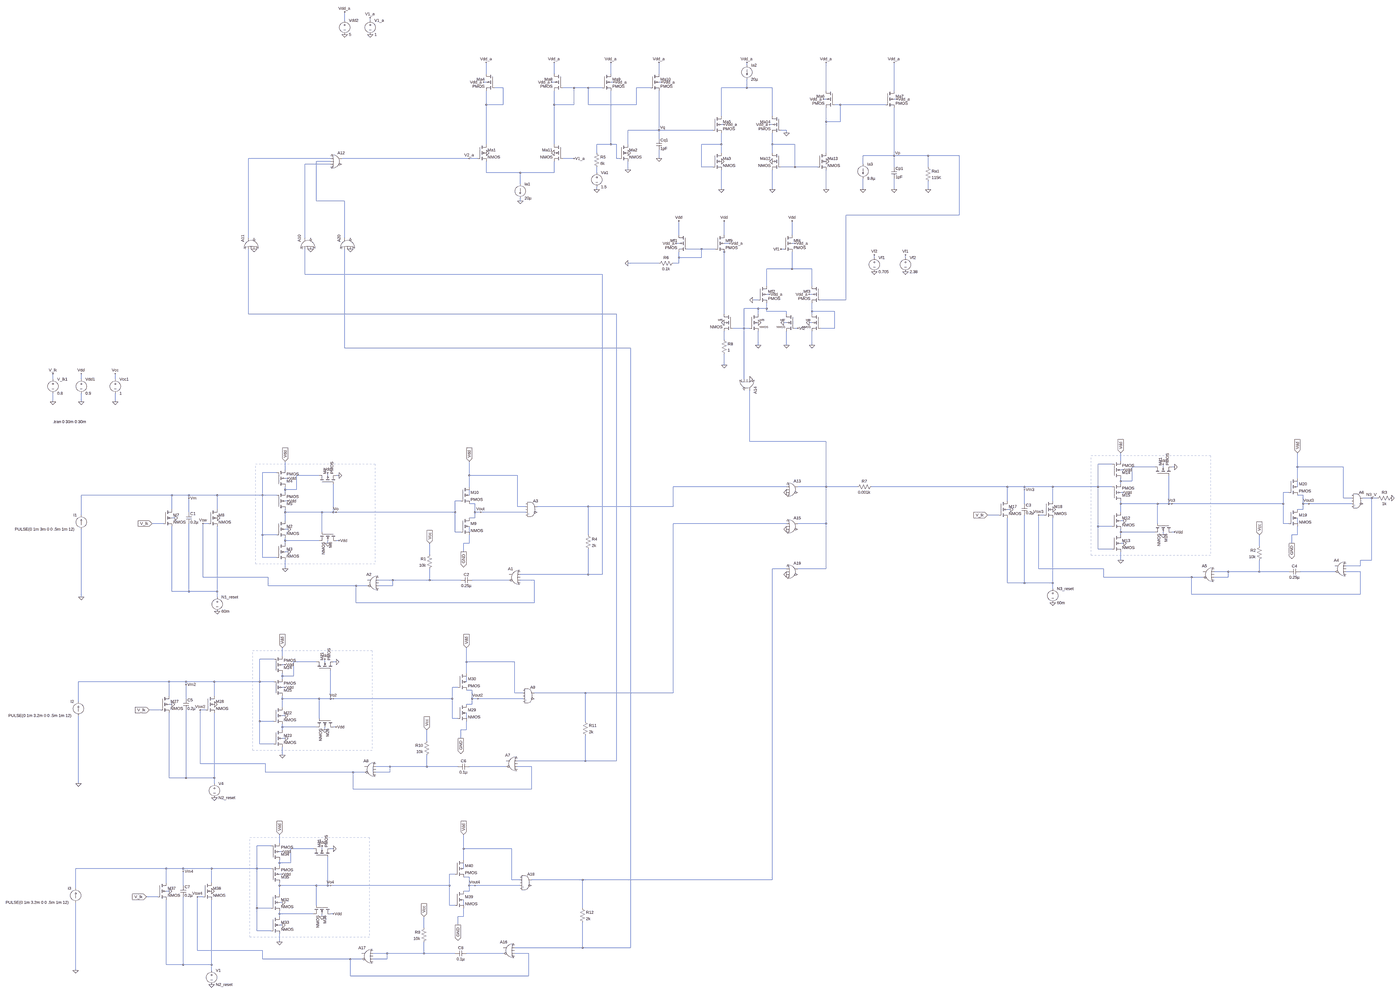
[diagram p0: schematic 2N-A.asc, whole sheet]
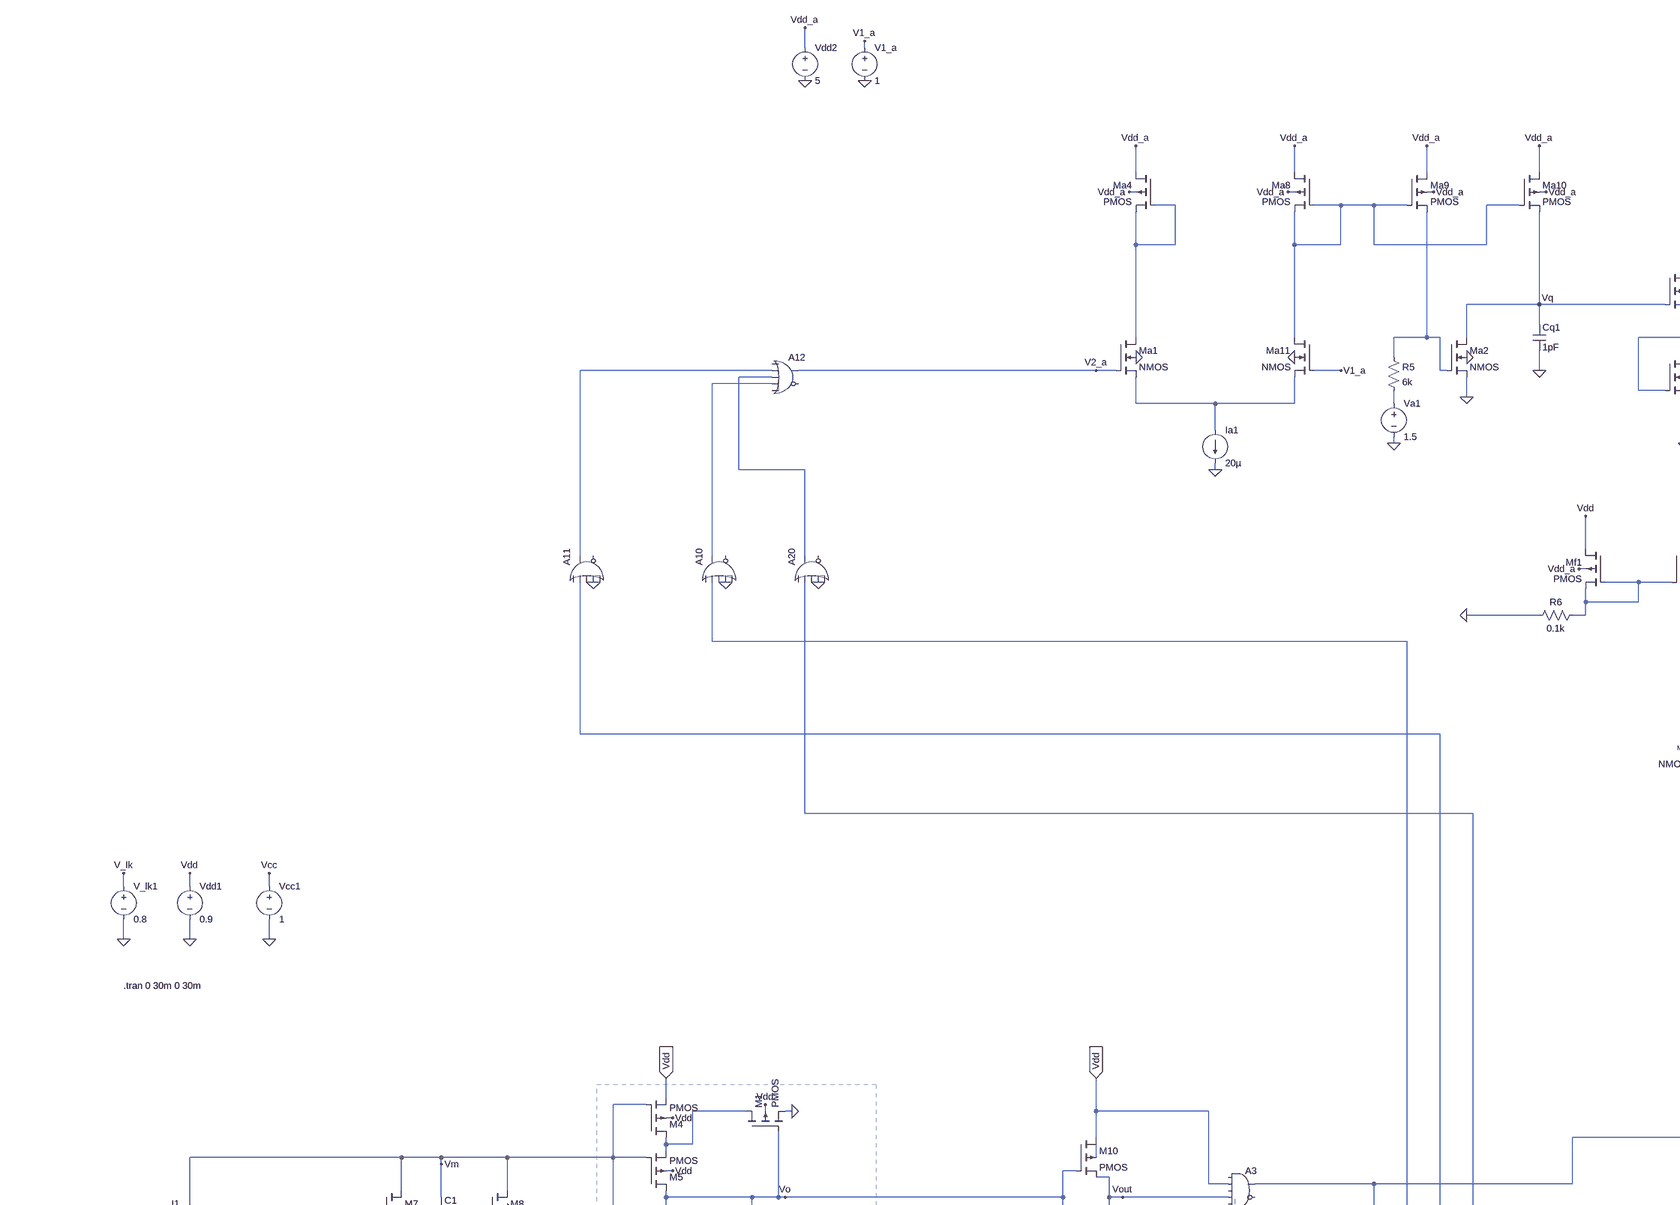
[diagram p1: schematic 2N-A.asc, part, row 1 of 2, column 1 of 2]
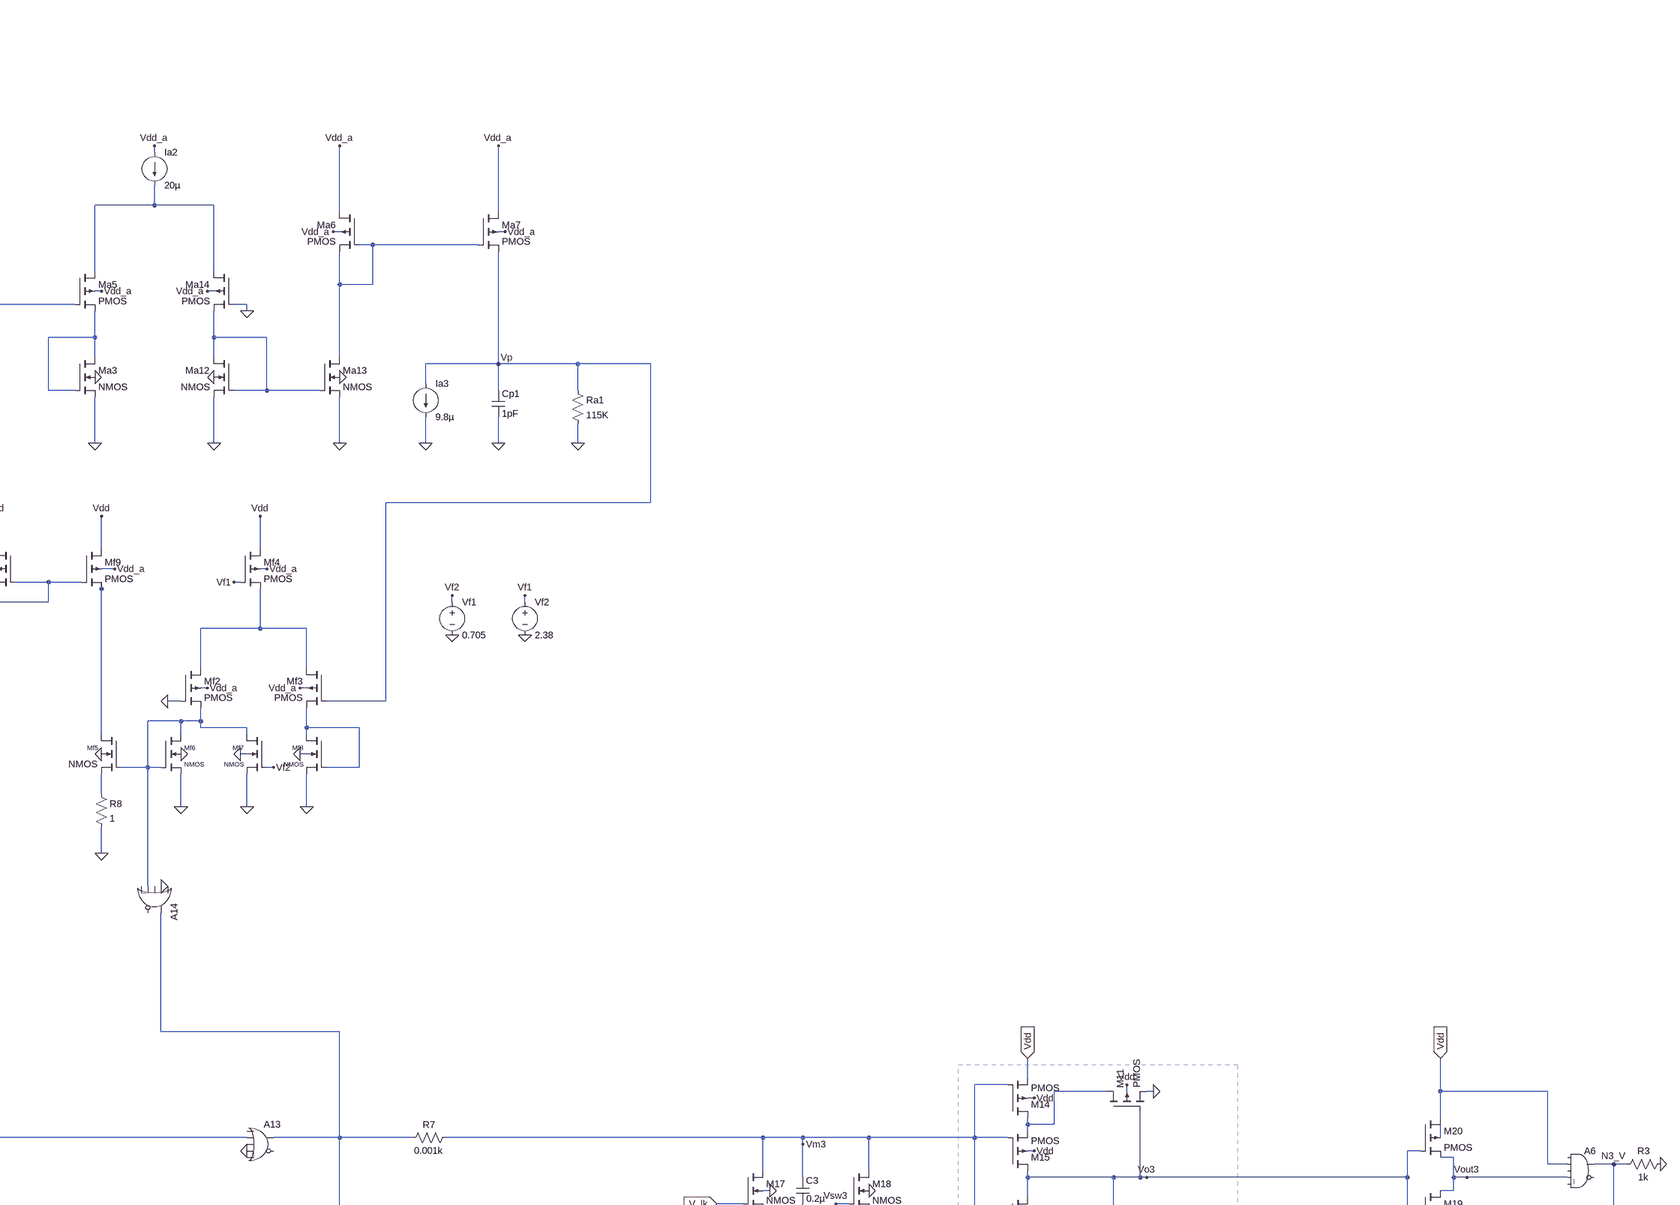
[diagram p2: schematic 2N-A.asc, part, row 1 of 2, column 2 of 2]
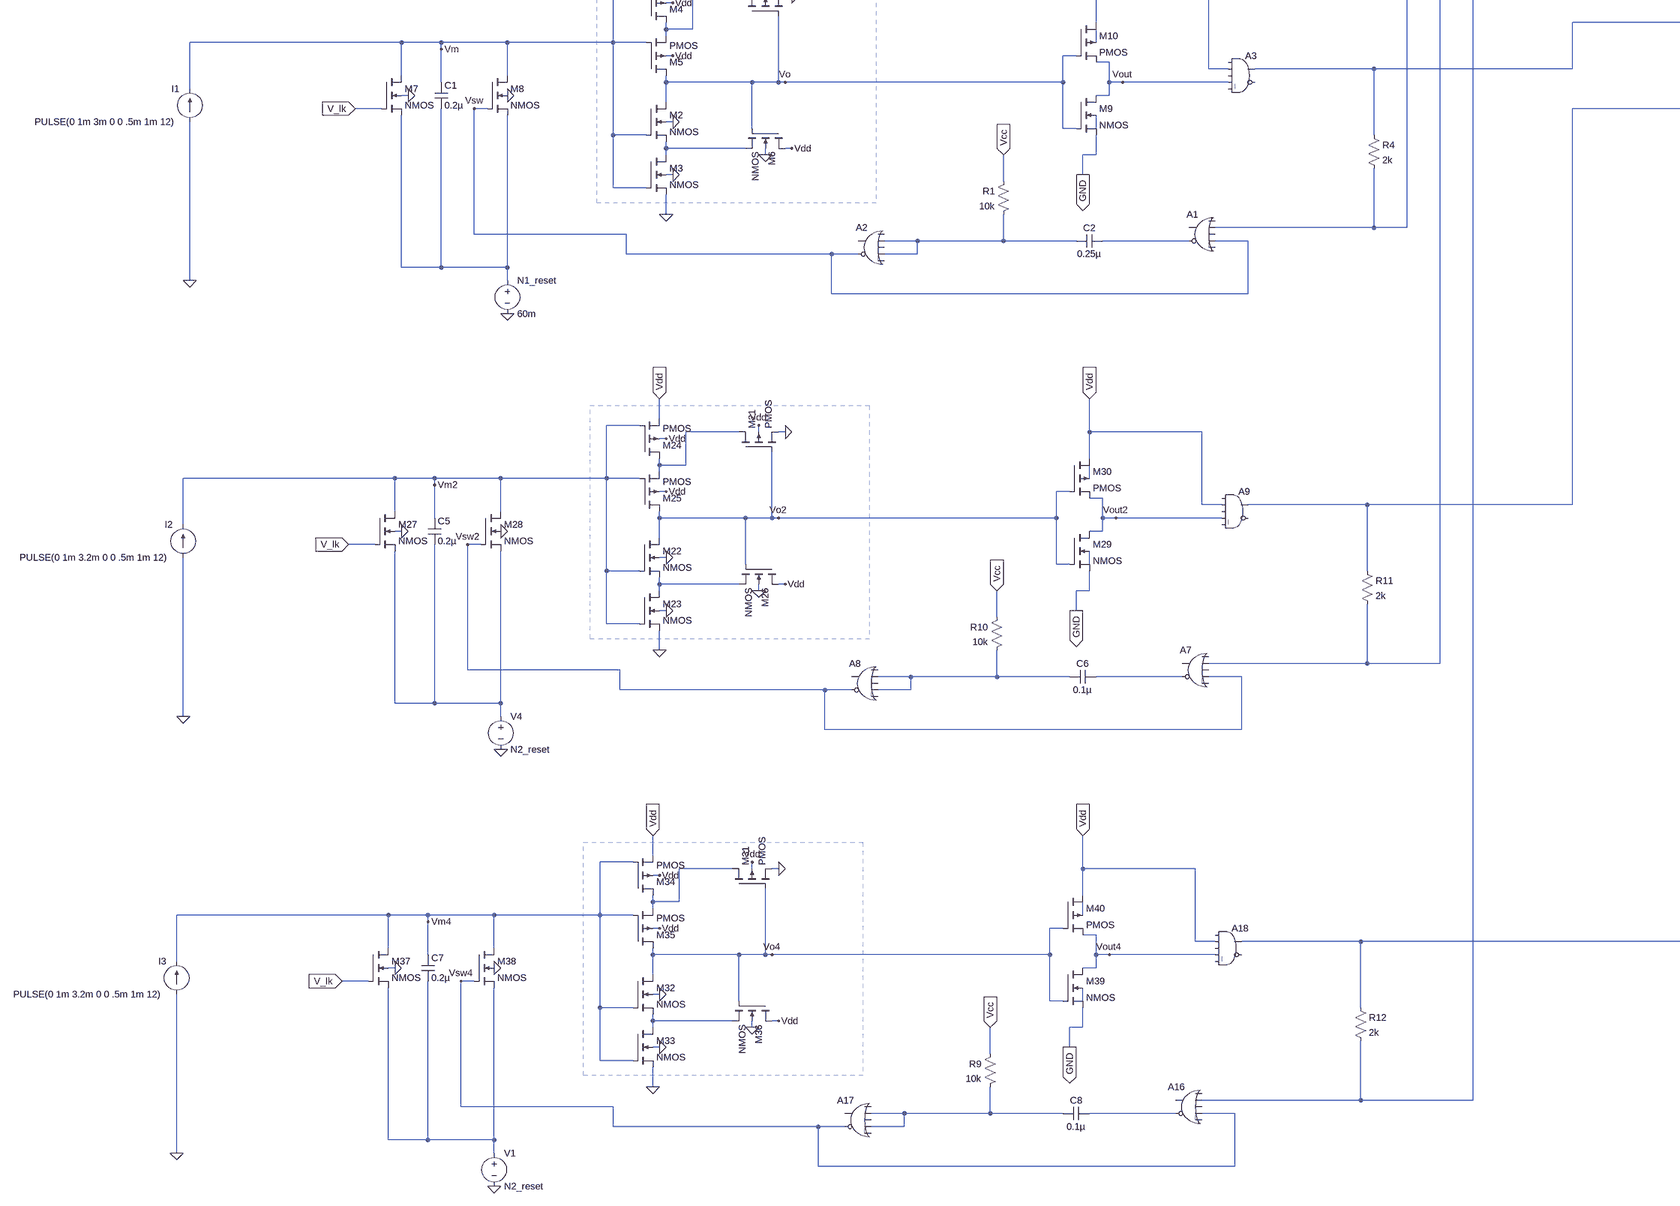
[diagram p3: schematic 2N-A.asc, part, row 2 of 2, column 1 of 2]
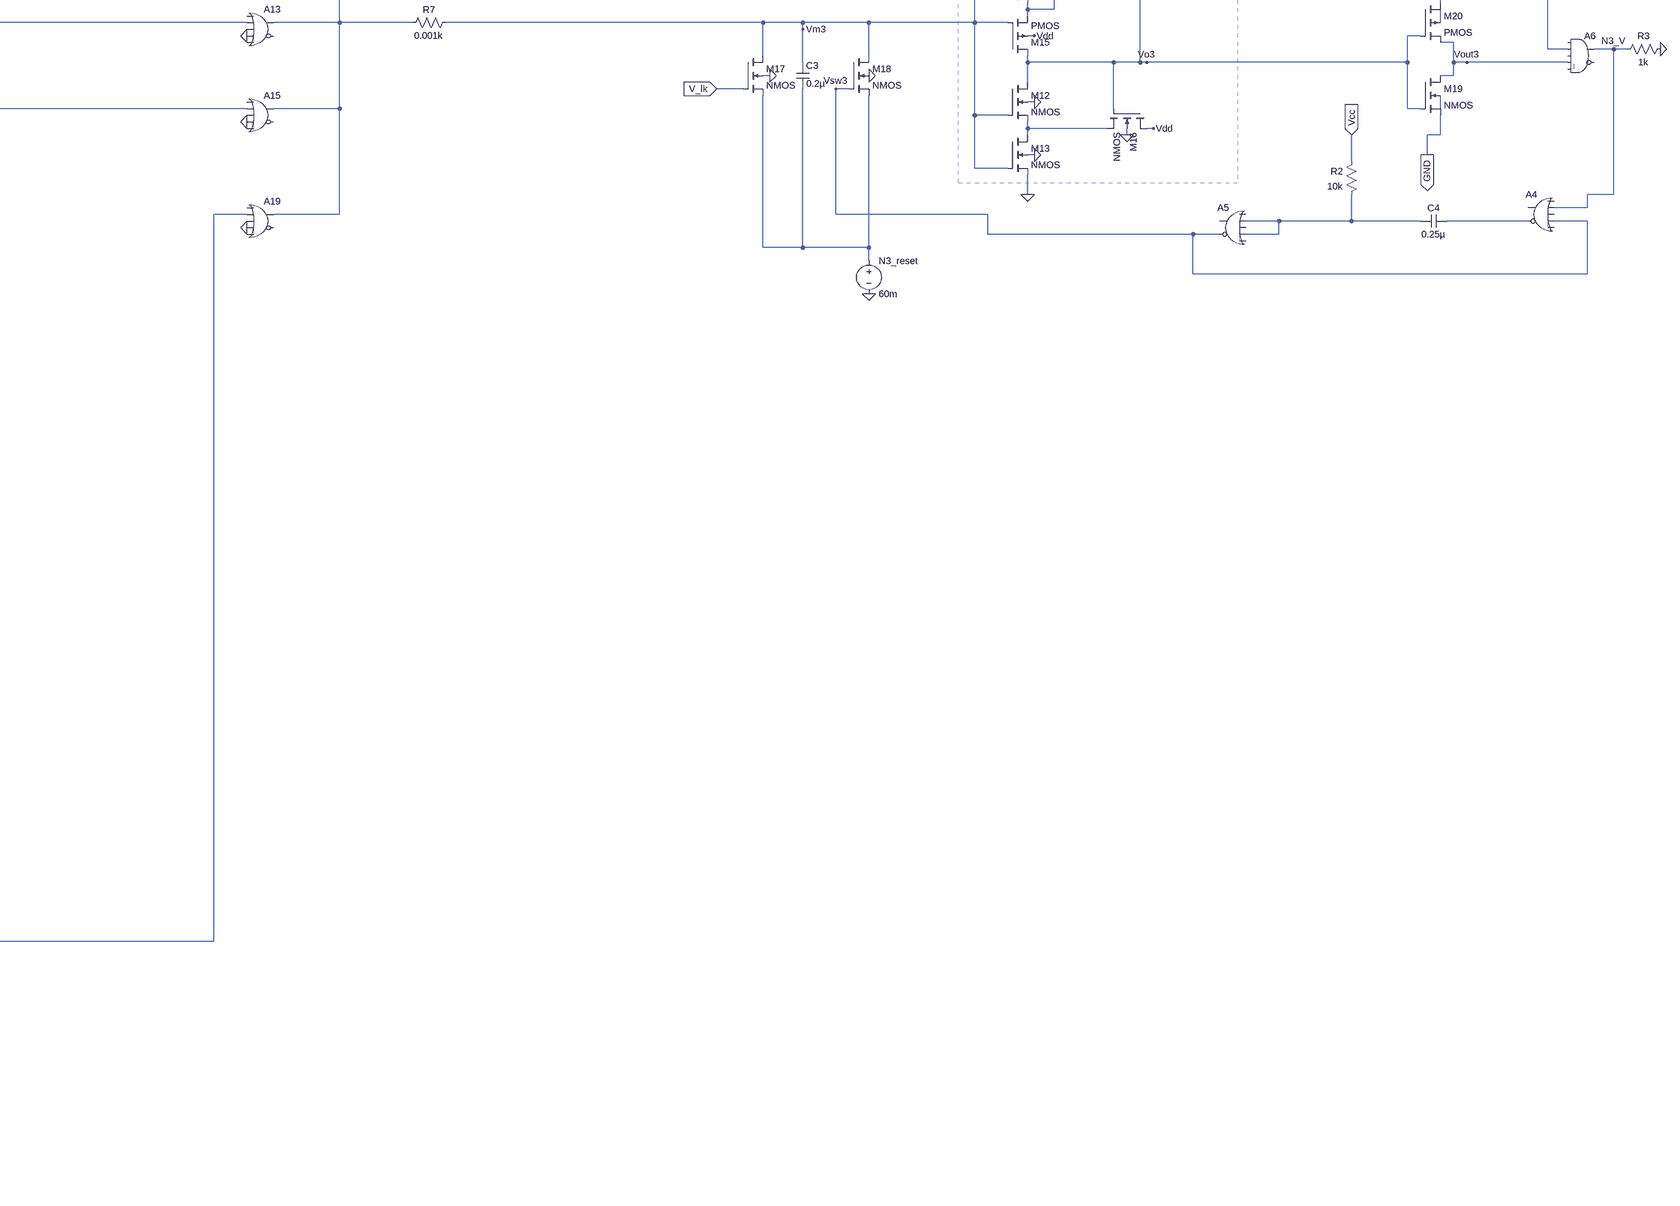
[diagram p4: schematic 2N-A.asc, part, row 2 of 2, column 2 of 2]
2N-A.asc, the LTspice schematic file:
Version 4
SHEET 1 5376 4688
WIRE -608 -1776 -608 -1824
WIRE -464 -1776 -464 -1792
WIRE 1664 -1216 1664 -1232
WIRE 192 -1168 192 -1232
WIRE 576 -1168 576 -1232
WIRE 896 -1168 896 -1232
WIRE 1168 -1168 1168 -1232
WIRE 192 -1120 176 -1120
WIRE 576 -1120 560 -1120
WIRE 912 -1120 896 -1120
WIRE 1184 -1120 1168 -1120
WIRE 288 -1088 240 -1088
WIRE 688 -1088 624 -1088
WIRE 768 -1088 688 -1088
WIRE 848 -1088 768 -1088
WIRE 1120 -1088 1040 -1088
WIRE 1664 -1088 1664 -1136
WIRE 1664 -1088 1520 -1088
WIRE 1808 -1088 1664 -1088
WIRE 2112 -1072 2112 -1232
WIRE 2496 -1072 2496 -1232
WIRE 2112 -1024 2096 -1024
WIRE 2512 -1024 2496 -1024
WIRE 192 -992 192 -1072
WIRE 288 -992 288 -1088
WIRE 288 -992 192 -992
WIRE 576 -992 576 -1072
WIRE 688 -992 688 -1088
WIRE 688 -992 576 -992
WIRE 768 -992 768 -1088
WIRE 1040 -992 1040 -1088
WIRE 1040 -992 768 -992
WIRE 2192 -992 2160 -992
WIRE 2448 -992 2192 -992
WIRE 1520 -928 1520 -1088
WIRE 1808 -928 1808 -1088
WIRE 2112 -896 2112 -976
WIRE 2192 -896 2192 -992
WIRE 2192 -896 2112 -896
WIRE 1536 -880 1520 -880
WIRE 1808 -880 1792 -880
WIRE 1168 -848 1168 -1072
WIRE 1168 -848 992 -848
WIRE 1472 -848 1168 -848
WIRE 1888 -848 1856 -848
WIRE 1888 -832 1888 -848
WIRE 1168 -800 1168 -848
WIRE 192 -768 192 -992
WIRE 576 -768 576 -992
WIRE 896 -768 896 -1072
WIRE 896 -768 816 -768
WIRE 928 -768 896 -768
WIRE 992 -768 992 -848
WIRE 1520 -768 1520 -832
WIRE 1520 -768 1408 -768
WIRE 1808 -768 1808 -832
WIRE 1936 -768 1808 -768
WIRE 816 -720 816 -768
WIRE 1520 -720 1520 -768
WIRE 1808 -720 1808 -768
WIRE 2112 -720 2112 -896
WIRE 2496 -704 2496 -976
WIRE 2496 -704 2320 -704
WIRE 2688 -704 2496 -704
WIRE 2864 -704 2688 -704
WIRE -688 -688 -1152 -688
WIRE 96 -688 -624 -688
WIRE 144 -688 96 -688
WIRE 688 -688 624 -688
WIRE 928 -688 928 -768
WIRE 944 -688 928 -688
WIRE 1168 -688 1168 -736
WIRE -688 -672 -768 -672
WIRE -688 -656 -832 -656
WIRE 2320 -656 2320 -704
WIRE 1408 -640 1408 -768
WIRE 1472 -640 1408 -640
WIRE 1936 -640 1936 -768
WIRE 1936 -640 1856 -640
WIRE 2064 -640 1936 -640
WIRE 2496 -640 2496 -704
WIRE 2688 -640 2688 -704
WIRE 992 -624 992 -672
WIRE 192 -608 192 -672
WIRE 384 -608 192 -608
WIRE 576 -608 576 -672
WIRE 576 -608 384 -608
WIRE 816 -608 816 -640
WIRE 384 -544 384 -608
WIRE 816 -512 816 -528
WIRE 1520 -512 1520 -624
WIRE 1808 -512 1808 -624
WIRE 2112 -512 2112 -624
WIRE 2320 -512 2320 -576
WIRE 2496 -512 2496 -576
WIRE 2688 -512 2688 -560
WIRE -768 -448 -768 -672
WIRE -608 -448 -768 -448
WIRE 384 -448 384 -464
WIRE 2864 -368 2864 -704
WIRE 2864 -368 2224 -368
WIRE 1280 -256 1280 -336
WIRE 1536 -256 1536 -336
WIRE 1920 -256 1920 -336
WIRE -1152 -240 -1152 -688
WIRE -832 -240 -832 -656
WIRE -608 -240 -608 -448
WIRE 1280 -208 1264 -208
WIRE 1568 -208 1536 -208
WIRE 1936 -208 1920 -208
WIRE 1408 -176 1328 -176
WIRE 1488 -176 1408 -176
WIRE 1872 -176 1856 -176
WIRE 1536 -160 1536 -176
WIRE 1280 -128 1280 -160
WIRE 1408 -128 1408 -176
WIRE 1408 -128 1280 -128
WIRE 2384 -128 2384 -144
WIRE 2560 -128 2560 -144
WIRE 1168 -96 992 -96
WIRE 1280 -96 1280 -128
WIRE 1280 -96 1248 -96
WIRE 1920 -64 1920 -160
WIRE 1920 -64 1776 -64
WIRE 2032 -64 1920 -64
WIRE -832 -32 -832 -176
WIRE 848 -32 -832 -32
WIRE 1776 32 1776 -64
WIRE 2032 32 2032 -64
WIRE 1792 80 1776 80
WIRE 2032 80 2016 80
WIRE 1728 112 1696 112
WIRE 2224 112 2224 -368
WIRE 2224 112 2080 112
WIRE 1728 160 1648 160
WIRE 1776 160 1776 128
WIRE 1776 160 1728 160
WIRE 1776 176 1776 160
WIRE 1888 176 1776 176
WIRE 2032 176 2032 128
WIRE 2160 176 2032 176
WIRE -1152 192 -1152 -176
WIRE 928 192 -1152 192
WIRE 1536 192 1536 -160
WIRE 1728 192 1728 160
WIRE 1888 192 1888 176
WIRE 2032 192 2032 176
WIRE 1888 240 1872 240
WIRE 2032 240 2016 240
WIRE 1648 272 1648 160
WIRE 1648 272 1584 272
WIRE 1680 272 1648 272
WIRE 1952 272 1936 272
WIRE 2160 272 2160 176
WIRE 2160 272 2080 272
WIRE 1536 336 1536 288
WIRE 1728 368 1728 288
WIRE 1888 368 1888 288
WIRE 2032 368 2032 288
WIRE -608 384 -608 -176
WIRE 1008 384 -608 384
WIRE 1536 480 1536 416
WIRE -2256 560 -2256 528
WIRE -2096 560 -2096 528
WIRE -1904 560 -1904 528
WIRE 1648 560 1648 272
WIRE -2256 688 -2256 640
WIRE -2096 688 -2096 640
WIRE -1904 688 -1904 640
WIRE 1680 912 1680 624
WIRE 2112 912 1680 912
WIRE 3776 1024 3776 976
WIRE 3728 1040 3648 1040
WIRE 3968 1056 3840 1056
WIRE 4016 1056 4016 1040
WIRE 4080 1056 4064 1056
WIRE 4816 1056 4816 976
WIRE 5088 1056 4816 1056
WIRE -944 1072 -944 1024
WIRE 3792 1072 3776 1072
WIRE -992 1088 -1072 1088
WIRE -752 1104 -880 1104
WIRE -704 1104 -704 1088
WIRE -640 1104 -656 1104
WIRE 96 1104 96 1024
WIRE 368 1104 96 1104
WIRE -928 1120 -944 1120
WIRE 4816 1120 4816 1056
WIRE 3776 1136 3776 1120
WIRE 3840 1136 3840 1056
WIRE 3840 1136 3776 1136
WIRE 3776 1152 3776 1136
WIRE 96 1168 96 1104
WIRE 1888 1168 1248 1168
WIRE 2112 1168 2112 912
WIRE 2112 1168 1952 1168
WIRE 2288 1168 2112 1168
WIRE 3136 1168 2368 1168
WIRE 3232 1168 3136 1168
WIRE 3392 1168 3232 1168
WIRE 3648 1168 3648 1040
WIRE 3648 1168 3392 1168
WIRE 3728 1168 3648 1168
WIRE 4816 1168 4816 1136
WIRE -944 1184 -944 1168
WIRE -880 1184 -880 1104
WIRE -880 1184 -944 1184
WIRE 3232 1184 3232 1168
WIRE -944 1200 -944 1184
WIRE 3792 1200 3776 1200
WIRE 4768 1200 4736 1200
WIRE -1584 1216 -2096 1216
WIRE -1488 1216 -1584 1216
WIRE -1328 1216 -1488 1216
WIRE -1072 1216 -1072 1088
WIRE -1072 1216 -1328 1216
WIRE -992 1216 -1072 1216
WIRE 96 1216 96 1184
WIRE 4848 1216 4816 1216
WIRE -1488 1232 -1488 1216
WIRE 5088 1232 5088 1056
WIRE 5136 1232 5088 1232
WIRE 5248 1232 5200 1232
WIRE 5280 1232 5248 1232
WIRE -928 1248 -944 1248
WIRE 48 1248 16 1248
WIRE 3136 1248 3136 1168
WIRE 3392 1248 3392 1168
WIRE 128 1264 96 1264
WIRE 3232 1264 3232 1184
WIRE 3776 1264 3776 1248
WIRE 3984 1264 3776 1264
WIRE 4048 1264 4048 1104
WIRE 4048 1264 3984 1264
WIRE 4064 1264 4048 1264
WIRE 4736 1264 4736 1200
WIRE 4736 1264 4064 1264
WIRE 4848 1264 4848 1216
WIRE 4880 1264 4848 1264
WIRE 5136 1264 4880 1264
WIRE 368 1280 368 1104
WIRE 416 1280 368 1280
WIRE 768 1280 480 1280
WIRE 1248 1280 1248 1168
WIRE 1248 1280 768 1280
WIRE -1584 1296 -1584 1216
WIRE -1328 1296 -1328 1216
WIRE 3152 1296 3136 1296
WIRE 4848 1296 4848 1264
WIRE 4848 1296 4816 1296
WIRE -1488 1312 -1488 1232
WIRE -944 1312 -944 1296
WIRE -736 1312 -944 1312
WIRE -672 1312 -672 1152
WIRE -672 1312 -736 1312
WIRE -656 1312 -672 1312
WIRE 16 1312 16 1248
WIRE 16 1312 -656 1312
WIRE 128 1312 128 1264
WIRE 160 1312 128 1312
WIRE 416 1312 160 1312
WIRE 3776 1312 3776 1264
WIRE -2096 1328 -2096 1216
WIRE 3088 1328 3024 1328
WIRE 3344 1328 3312 1328
WIRE -1568 1344 -1584 1344
WIRE 128 1344 128 1312
WIRE 128 1344 96 1344
WIRE -944 1360 -944 1312
WIRE 3792 1360 3776 1360
WIRE -1632 1376 -1696 1376
WIRE -1376 1376 -1408 1376
WIRE 1888 1376 1248 1376
WIRE 2112 1376 2112 1168
WIRE 2112 1376 1952 1376
WIRE 3984 1376 3984 1264
WIRE 4736 1376 4736 1264
WIRE 4768 1376 4736 1376
WIRE 4816 1376 4816 1344
WIRE 3648 1392 3648 1168
WIRE 3728 1392 3648 1392
WIRE -928 1408 -944 1408
WIRE -736 1424 -736 1312
WIRE 16 1424 16 1312
WIRE 48 1424 16 1424
WIRE 96 1424 96 1392
WIRE 3776 1424 3776 1408
WIRE 3968 1424 3776 1424
WIRE 4080 1424 4064 1424
WIRE -1072 1440 -1072 1216
WIRE -992 1440 -1072 1440
WIRE 768 1440 768 1280
WIRE 3776 1440 3776 1424
WIRE 4016 1440 4016 1424
WIRE 4816 1440 4816 1392
WIRE 4816 1440 4784 1440
WIRE -944 1472 -944 1456
WIRE -752 1472 -944 1472
WIRE -640 1472 -656 1472
WIRE -944 1488 -944 1472
WIRE -704 1488 -704 1472
WIRE 96 1488 96 1440
WIRE 96 1488 64 1488
WIRE 3792 1488 3776 1488
WIRE 4784 1488 4784 1440
WIRE 4592 1504 4592 1440
WIRE 3648 1520 3648 1392
WIRE 3728 1520 3648 1520
WIRE -928 1536 -944 1536
WIRE 64 1536 64 1488
WIRE -128 1552 -128 1488
WIRE -1072 1568 -1072 1440
WIRE -992 1568 -1072 1568
WIRE 3776 1584 3776 1536
WIRE 5248 1584 5248 1232
WIRE 5248 1584 5184 1584
WIRE 5184 1616 5184 1584
WIRE 5184 1616 5104 1616
WIRE -944 1632 -944 1584
WIRE 1888 1632 1808 1632
WIRE 2112 1632 2112 1376
WIRE 2112 1632 1952 1632
WIRE 3312 1632 3312 1328
WIRE 3680 1632 3312 1632
WIRE 4384 1648 4304 1648
WIRE 4592 1648 4592 1584
WIRE 4592 1648 4384 1648
WIRE 4768 1648 4592 1648
WIRE 5040 1648 4832 1648
WIRE 5184 1648 5104 1648
WIRE 768 1664 768 1520
WIRE 768 1664 384 1664
WIRE 848 1664 848 -32
WIRE 848 1664 768 1664
WIRE -1408 1680 -1408 1376
WIRE -1040 1680 -1408 1680
WIRE 3680 1680 3680 1632
WIRE 4176 1680 3680 1680
WIRE 4240 1680 4176 1680
WIRE 4384 1680 4384 1648
WIRE 4384 1680 4304 1680
WIRE -336 1696 -416 1696
WIRE -128 1696 -128 1632
WIRE -128 1696 -336 1696
WIRE 48 1696 -128 1696
WIRE 320 1696 112 1696
WIRE 464 1696 384 1696
WIRE 3136 1712 3136 1344
WIRE 3232 1712 3232 1328
WIRE 3232 1712 3136 1712
WIRE 3392 1712 3392 1344
WIRE 3392 1712 3232 1712
WIRE -1040 1728 -1040 1680
WIRE -544 1728 -1040 1728
WIRE -480 1728 -544 1728
WIRE -336 1728 -336 1696
WIRE -336 1728 -416 1728
WIRE 3392 1744 3392 1712
WIRE -1584 1760 -1584 1392
WIRE -1488 1760 -1488 1376
WIRE -1488 1760 -1584 1760
WIRE -1328 1760 -1328 1392
WIRE -1328 1760 -1488 1760
WIRE 4176 1776 4176 1680
WIRE 5184 1776 5184 1648
WIRE 5184 1776 4176 1776
WIRE -2096 1792 -2096 1408
WIRE -1328 1792 -1328 1760
WIRE -544 1824 -544 1728
WIRE 464 1824 464 1696
WIRE 464 1824 -544 1824
WIRE -960 2480 -960 2432
WIRE -1008 2496 -1088 2496
WIRE -768 2512 -896 2512
WIRE -720 2512 -720 2496
WIRE -656 2512 -672 2512
WIRE 80 2512 80 2432
WIRE 352 2512 80 2512
WIRE -944 2528 -960 2528
WIRE 80 2576 80 2512
WIRE -960 2592 -960 2576
WIRE -896 2592 -896 2512
WIRE -896 2592 -960 2592
WIRE -960 2608 -960 2592
WIRE -1600 2624 -2112 2624
WIRE -1504 2624 -1600 2624
WIRE -1344 2624 -1504 2624
WIRE -1088 2624 -1088 2496
WIRE -1088 2624 -1344 2624
WIRE -1008 2624 -1088 2624
WIRE 80 2624 80 2592
WIRE -1504 2640 -1504 2624
WIRE -944 2656 -960 2656
WIRE 32 2656 0 2656
WIRE 112 2672 80 2672
WIRE 352 2688 352 2512
WIRE 400 2688 352 2688
WIRE 752 2688 464 2688
WIRE 1248 2688 1248 1376
WIRE 1248 2688 752 2688
WIRE -1600 2704 -1600 2624
WIRE -1344 2704 -1344 2624
WIRE -1504 2720 -1504 2640
WIRE -960 2720 -960 2704
WIRE -752 2720 -960 2720
WIRE -688 2720 -688 2560
WIRE -688 2720 -752 2720
WIRE -672 2720 -688 2720
WIRE 0 2720 0 2656
WIRE 0 2720 -672 2720
WIRE 112 2720 112 2672
WIRE 144 2720 112 2720
WIRE 400 2720 144 2720
WIRE -2112 2736 -2112 2624
WIRE -1584 2752 -1600 2752
WIRE 112 2752 112 2720
WIRE 112 2752 80 2752
WIRE -960 2768 -960 2720
WIRE -1648 2784 -1712 2784
WIRE -1392 2784 -1424 2784
WIRE -944 2816 -960 2816
WIRE -752 2832 -752 2720
WIRE 0 2832 0 2720
WIRE 32 2832 0 2832
WIRE 80 2832 80 2800
WIRE -1088 2848 -1088 2624
WIRE -1008 2848 -1088 2848
WIRE 752 2848 752 2688
WIRE -960 2880 -960 2864
WIRE -768 2880 -960 2880
WIRE -656 2880 -672 2880
WIRE -960 2896 -960 2880
WIRE -720 2896 -720 2880
WIRE 80 2896 80 2848
WIRE 80 2896 48 2896
WIRE -944 2944 -960 2944
WIRE 48 2944 48 2896
WIRE -144 2960 -144 2896
WIRE -1088 2976 -1088 2848
WIRE -1008 2976 -1088 2976
WIRE -960 3040 -960 2992
WIRE 752 3072 752 2928
WIRE 752 3072 368 3072
WIRE 928 3072 928 192
WIRE 928 3072 752 3072
WIRE -1424 3088 -1424 2784
WIRE -1056 3088 -1424 3088
WIRE -352 3104 -432 3104
WIRE -144 3104 -144 3040
WIRE -144 3104 -352 3104
WIRE 32 3104 -144 3104
WIRE 304 3104 96 3104
WIRE 448 3104 368 3104
WIRE -1056 3136 -1056 3088
WIRE -560 3136 -1056 3136
WIRE -496 3136 -560 3136
WIRE -352 3136 -352 3104
WIRE -352 3136 -432 3136
WIRE -1600 3168 -1600 2800
WIRE -1504 3168 -1504 2784
WIRE -1504 3168 -1600 3168
WIRE -1344 3168 -1344 2800
WIRE -1344 3168 -1504 3168
WIRE -2112 3200 -2112 2816
WIRE -1344 3200 -1344 3168
WIRE -560 3232 -560 3136
WIRE 448 3232 448 3104
WIRE 448 3232 -560 3232
WIRE -976 3872 -976 3824
WIRE -1024 3888 -1104 3888
WIRE -784 3904 -912 3904
WIRE -736 3904 -736 3888
WIRE -672 3904 -688 3904
WIRE 64 3904 64 3824
WIRE 336 3904 64 3904
WIRE -960 3920 -976 3920
WIRE 64 3968 64 3904
WIRE -976 3984 -976 3968
WIRE -912 3984 -912 3904
WIRE -912 3984 -976 3984
WIRE -976 4000 -976 3984
WIRE -1616 4016 -2128 4016
WIRE -1520 4016 -1616 4016
WIRE -1360 4016 -1520 4016
WIRE -1104 4016 -1104 3888
WIRE -1104 4016 -1360 4016
WIRE -1024 4016 -1104 4016
WIRE 64 4016 64 3984
WIRE -1520 4032 -1520 4016
WIRE -960 4048 -976 4048
WIRE 16 4048 -16 4048
WIRE 96 4064 64 4064
WIRE 336 4080 336 3904
WIRE 384 4080 336 4080
WIRE 736 4080 448 4080
WIRE 1808 4080 1808 1632
WIRE 1808 4080 736 4080
WIRE -1616 4096 -1616 4016
WIRE -1360 4096 -1360 4016
WIRE -1520 4112 -1520 4032
WIRE -976 4112 -976 4096
WIRE -768 4112 -976 4112
WIRE -704 4112 -704 3952
WIRE -704 4112 -768 4112
WIRE -688 4112 -704 4112
WIRE -16 4112 -16 4048
WIRE -16 4112 -688 4112
WIRE 96 4112 96 4064
WIRE 128 4112 96 4112
WIRE 384 4112 128 4112
WIRE -2128 4128 -2128 4016
WIRE -1600 4144 -1616 4144
WIRE 96 4144 96 4112
WIRE 96 4144 64 4144
WIRE -976 4160 -976 4112
WIRE -1664 4176 -1728 4176
WIRE -1408 4176 -1440 4176
WIRE -960 4208 -976 4208
WIRE -768 4224 -768 4112
WIRE -16 4224 -16 4112
WIRE 16 4224 -16 4224
WIRE 64 4224 64 4192
WIRE -1104 4240 -1104 4016
WIRE -1024 4240 -1104 4240
WIRE 736 4240 736 4080
WIRE -976 4272 -976 4256
WIRE -784 4272 -976 4272
WIRE -672 4272 -688 4272
WIRE -976 4288 -976 4272
WIRE -736 4288 -736 4272
WIRE 64 4288 64 4240
WIRE 64 4288 32 4288
WIRE -960 4336 -976 4336
WIRE 32 4336 32 4288
WIRE -160 4352 -160 4288
WIRE -1104 4368 -1104 4240
WIRE -1024 4368 -1104 4368
WIRE -976 4432 -976 4384
WIRE 736 4464 736 4320
WIRE 736 4464 352 4464
WIRE 1008 4464 1008 384
WIRE 1008 4464 736 4464
WIRE -1440 4480 -1440 4176
WIRE -1072 4480 -1440 4480
WIRE -368 4496 -448 4496
WIRE -160 4496 -160 4432
WIRE -160 4496 -368 4496
WIRE 16 4496 -160 4496
WIRE 288 4496 80 4496
WIRE 432 4496 352 4496
WIRE -1072 4528 -1072 4480
WIRE -576 4528 -1072 4528
WIRE -512 4528 -576 4528
WIRE -368 4528 -368 4496
WIRE -368 4528 -448 4528
WIRE -1616 4560 -1616 4192
WIRE -1520 4560 -1520 4176
WIRE -1520 4560 -1616 4560
WIRE -1360 4560 -1360 4192
WIRE -1360 4560 -1520 4560
WIRE -2128 4592 -2128 4208
WIRE -1360 4592 -1360 4560
WIRE -576 4624 -576 4528
WIRE 432 4624 432 4496
WIRE 432 4624 -576 4624
FLAG -656 1312 Vo
FLAG -928 1408 0
FLAG -928 1536 0
FLAG -704 1488 0
FLAG -944 1632 0
FLAG -640 1104 0
FLAG -1696 1376 V_lk
IOPIN -1696 1376 In
FLAG -1568 1344 0
FLAG -1408 1376 Vsw
FLAG -1328 1344 0
FLAG -944 1024 Vdd
IOPIN -944 1024 In
FLAG -928 1120 Vdd
FLAG -928 1248 Vdd
FLAG -640 1472 Vdd
FLAG -704 1088 Vdd
FLAG -2096 688 0
FLAG -2256 688 0
FLAG -2096 528 Vdd
FLAG -2256 528 V_lk
FLAG -2096 1792 0
FLAG -1488 1232 Vm
FLAG -1904 688 0
FLAG -1904 528 Vcc
FLAG 64 1536 GND
IOPIN 64 1536 Out
FLAG 96 1024 Vdd
IOPIN 96 1024 In
FLAG 160 1312 Vout
FLAG -128 1488 Vcc
IOPIN -128 1488 In
FLAG 4064 1264 Vo3
FLAG 3792 1360 0
FLAG 3792 1488 0
FLAG 4016 1440 0
FLAG 3776 1584 0
FLAG 4080 1056 0
FLAG 3024 1328 V_lk
IOPIN 3024 1328 In
FLAG 3152 1296 0
FLAG 3392 1296 0
FLAG 3776 976 Vdd
IOPIN 3776 976 In
FLAG 3792 1072 Vdd
FLAG 3792 1200 Vdd
FLAG 4080 1424 Vdd
FLAG 4016 1040 Vdd
FLAG 3232 1184 Vm3
FLAG 4784 1488 GND
IOPIN 4784 1488 Out
FLAG 4816 976 Vdd
IOPIN 4816 976 In
FLAG 4880 1264 Vout3
FLAG 4592 1440 Vcc
IOPIN 4592 1440 In
FLAG 5360 1232 0
FLAG 192 -720 0
FLAG 992 -720 0
FLAG 1168 -688 0
FLAG 992 -624 0
FLAG 816 -512 0
FLAG 1888 -832 0
FLAG 2688 -512 0
FLAG 2496 -512 0
FLAG 2320 -512 0
FLAG 1808 -512 0
FLAG 1520 -512 0
FLAG 1168 -848 Vq
FLAG 576 -720 0
FLAG 2112 -672 0
FLAG 1808 -672 0
FLAG 1520 -672 0
FLAG 688 -688 V1_a
FLAG 96 -688 V2_a
FLAG 384 -448 0
FLAG 2112 -512 0
FLAG 192 -1232 Vdd_a
FLAG 576 -1232 Vdd_a
FLAG 896 -1232 Vdd_a
FLAG 1168 -1232 Vdd_a
FLAG 176 -1120 Vdd_a
FLAG 560 -1120 Vdd_a
FLAG 912 -1120 Vdd_a
FLAG 1664 -1232 Vdd_a
FLAG 1536 -880 Vdd_a
FLAG 1792 -880 Vdd_a
FLAG 2112 -1232 Vdd_a
FLAG 2496 -1232 Vdd_a
FLAG 2096 -1024 Vdd_a
FLAG 2512 -1024 Vdd_a
FLAG 1184 -1120 Vdd_a
FLAG -608 -1696 0
FLAG -608 -1824 Vdd_a
FLAG 2496 -704 Vp
FLAG 1728 368 0
FLAG 2032 368 0
FLAG 1888 368 0
FLAG 2016 240 0
FLAG 1872 240 0
FLAG 1728 240 0
FLAG 1536 240 0
FLAG 1696 112 0
FLAG 1952 272 Vf2
FLAG 1856 -176 Vf1
FLAG 1920 -336 Vdd
FLAG 1536 -336 Vdd
FLAG 1280 -336 Vdd
FLAG 1792 80 Vdd_a
FLAG 2016 80 Vdd_a
FLAG 1264 -208 Vdd_a
FLAG 1936 -208 Vdd_a
FLAG 2560 -48 0
FLAG 2384 -48 0
FLAG 2384 -144 Vf2
FLAG 2560 -144 Vf1
FLAG -464 -1696 0
FLAG -464 -1792 V1_a
FLAG 1568 -208 Vdd_a
FLAG 992 -96 0
FLAG 3392 1824 0
FLAG -1328 1872 0
FLAG 3312 1328 Vsw3
FLAG -672 2720 Vo2
FLAG -944 2816 0
FLAG -944 2944 0
FLAG -720 2896 0
FLAG -960 3040 0
FLAG -656 2512 0
FLAG -1712 2784 V_lk
IOPIN -1712 2784 In
FLAG -1584 2752 0
FLAG -1424 2784 Vsw2
FLAG -1344 2752 0
FLAG -960 2432 Vdd
IOPIN -960 2432 In
FLAG -944 2528 Vdd
FLAG -944 2656 Vdd
FLAG -656 2880 Vdd
FLAG -720 2496 Vdd
FLAG -2112 3200 0
FLAG -1504 2640 Vm2
FLAG 48 2944 GND
IOPIN 48 2944 Out
FLAG 80 2432 Vdd
IOPIN 80 2432 In
FLAG 144 2720 Vout2
FLAG -144 2896 Vcc
IOPIN -144 2896 In
FLAG -1344 3280 0
FLAG 5248 1232 N3_V
FLAG 1536 480 0
FLAG -800 -176 0
FLAG -1120 -176 0
FLAG 1680 560 0
FLAG 1888 1200 0
FLAG 1888 1408 0
FLAG -688 4112 Vo4
FLAG -960 4208 0
FLAG -960 4336 0
FLAG -736 4288 0
FLAG -976 4432 0
FLAG -672 3904 0
FLAG -1728 4176 V_lk
IOPIN -1728 4176 In
FLAG -1600 4144 0
FLAG -1440 4176 Vsw4
FLAG -1360 4144 0
FLAG -976 3824 Vdd
IOPIN -976 3824 In
FLAG -960 3920 Vdd
FLAG -960 4048 Vdd
FLAG -672 4272 Vdd
FLAG -736 3888 Vdd
FLAG -2128 4592 0
FLAG -1520 4032 Vm4
FLAG 32 4336 GND
IOPIN 32 4336 Out
FLAG 64 3824 Vdd
IOPIN 64 3824 In
FLAG 128 4112 Vout4
FLAG -160 4288 Vcc
IOPIN -160 4288 In
FLAG -1360 4672 0
FLAG 1888 1664 0
FLAG -576 -176 0
SYMBOL pmos4 -752 1152 R270
SYMATTR InstName M1
SYMATTR Value2 l=50n w=1u
SYMBOL nmos4 -992 1360 R0
SYMATTR InstName M2
SYMATTR Value2 l=50n w=500n
SYMBOL nmos4 -992 1488 R0
SYMATTR InstName M3
SYMATTR Value2 l=50n w=500n
SYMBOL pmos4 -992 1168 M180
SYMATTR InstName M4
SYMATTR Value2 l=50n w=1u
SYMBOL pmos4 -992 1296 M180
SYMATTR InstName M5
SYMATTR Value2 l=50n w=1u
SYMBOL nmos4 -656 1424 R90
SYMATTR InstName M6
SYMATTR Value2 l=50n w=1.125u
SYMBOL cap -1504 1312 R0
SYMATTR InstName C1
SYMATTR Value 0.2µ
SYMATTR SpiceLine Rser=333k Cpar=0.0000003
SYMBOL nmos4 -1632 1296 R0
SYMATTR InstName M7
SYMATTR Value2 l=5u w=500u
SYMBOL nmos4 -1376 1296 R0
SYMATTR InstName M8
SYMATTR Value2 l=5u w=500u
SYMBOL voltage -2096 544 R0
SYMATTR InstName Vdd1
SYMATTR Value 0.9
SYMATTR SpiceLine Rser=1M
SYMBOL voltage -2256 544 R0
SYMATTR InstName V_lk1
SYMATTR Value 0.8
SYMBOL current -2096 1408 R180
WINDOW 0 24 80 Left 2
WINDOW 3 24 0 Left 2
SYMATTR InstName I1
SYMATTR Value PULSE(0 1m 3m 0 0 .5m 1m 12)
SYMBOL voltage -1904 544 R0
SYMATTR InstName Vcc1
SYMATTR Value 1
SYMBOL nmos4 48 1344 R0
SYMATTR InstName M9
SYMATTR Value2 l=50n w=250n
SYMBOL pmos4 48 1168 R0
SYMATTR InstName M10
SYMATTR Value2 l=50n w=1u
SYMBOL cap 48 1712 R270
WINDOW 0 32 32 VTop 2
WINDOW 3 0 32 VBottom 2
SYMATTR InstName C2
SYMATTR Value 0.25µ
SYMBOL res -112 1536 M0
SYMATTR InstName R1
SYMATTR Value 10k
SYMBOL Digital/or 352 1616 M0
SYMATTR InstName A1
SYMBOL Digital/or -448 1648 M0
SYMATTR InstName A2
SYMBOL Digital/and 448 1232 R0
SYMATTR InstName A3
SYMBOL pmos4 3968 1104 R270
SYMATTR InstName M11
SYMATTR Value2 l=50n w=1u
SYMBOL nmos4 3728 1312 R0
SYMATTR InstName M12
SYMATTR Value2 l=50n w=500n
SYMBOL nmos4 3728 1440 R0
SYMATTR InstName M13
SYMATTR Value2 l=50n w=500n
SYMBOL pmos4 3728 1120 M180
SYMATTR InstName M14
SYMATTR Value2 l=50n w=1u
SYMBOL pmos4 3728 1248 M180
SYMATTR InstName M15
SYMATTR Value2 l=50n w=1u
SYMBOL nmos4 4064 1376 R90
SYMATTR InstName M16
SYMATTR Value2 l=50n w=1.125u
SYMBOL cap 3216 1264 R0
WINDOW 3 48 67 Bottom 2
SYMATTR Value 0.2µ
SYMATTR InstName C3
SYMATTR SpiceLine Rser=333k Cpar=0.0000003
SYMBOL nmos4 3088 1248 R0
SYMATTR InstName M17
SYMATTR Value2 l=5u w=500u
SYMBOL nmos4 3344 1248 R0
SYMATTR InstName M18
SYMATTR Value2 l=5u w=500u
SYMBOL nmos4 4768 1296 R0
SYMATTR InstName M19
SYMATTR Value2 l=50n w=250n
SYMBOL pmos4 4768 1120 R0
SYMATTR InstName M20
SYMATTR Value2 l=50n w=1u
SYMBOL cap 4768 1664 R270
WINDOW 0 32 32 VTop 2
WINDOW 3 0 32 VBottom 2
SYMATTR InstName C4
SYMATTR Value 0.25µ
SYMBOL res 4608 1488 M0
SYMATTR InstName R2
SYMATTR Value 10k
SYMBOL Digital/or 5072 1568 M0
SYMATTR InstName A4
SYMBOL Digital/or 4272 1600 M0
SYMATTR InstName A5
SYMBOL Digital/and 5168 1184 R0
SYMATTR InstName A6
SYMBOL res 5376 1216 R90
WINDOW 0 0 56 VBottom 2
WINDOW 3 32 56 VTop 2
SYMATTR InstName R3
SYMATTR Value 1k
SYMBOL res 752 1424 R0
SYMATTR InstName R4
SYMATTR Value 2k
SYMBOL nmos4 144 -768 R0
SYMATTR InstName Ma1
SYMATTR Value2 l=250n w=45n
SYMBOL nmos4 944 -768 R0
SYMATTR InstName Ma2
SYMATTR Value2 l=250n w=50n
SYMBOL cap 1152 -800 R0
SYMATTR InstName Cq1
SYMATTR Value 1pF
SYMBOL res 800 -736 R0
SYMATTR InstName R5
SYMATTR Value 6k
SYMBOL voltage 816 -624 R0
SYMATTR InstName Va1
SYMATTR Value 1.5
SYMBOL nmos4 1472 -720 R0
SYMATTR InstName Ma3
SYMATTR Value2 l=50n w=500n
SYMBOL pmos4 240 -1168 M0
SYMATTR InstName Ma4
SYMATTR Value2 l=50n w=500n
SYMBOL pmos4 1472 -928 R0
SYMATTR InstName Ma5
SYMATTR Value2 l=50n w=500n
SYMBOL pmos4 2160 -1072 M0
SYMATTR InstName Ma6
SYMATTR Value2 l=50n w=460n
SYMBOL pmos4 2448 -1072 R0
SYMATTR InstName Ma7
SYMATTR Value2 l=50n w=460n
SYMBOL cap 2480 -640 R0
SYMATTR InstName Cp1
SYMATTR Value 1pF
SYMBOL res 2672 -656 R0
SYMATTR InstName Ra1
SYMATTR Value 115K
SYMBOL current 384 -544 R0
SYMATTR InstName Ia1
SYMATTR Value 20µ
SYMBOL current 1664 -1216 R0
SYMATTR InstName Ia2
SYMATTR Value 20µ
SYMBOL current 2320 -656 R0
SYMATTR InstName Ia3
SYMATTR Value 9.8µ
SYMBOL pmos4 624 -1168 M0
SYMATTR InstName Ma8
SYMATTR Value2 l=50n w=500n
SYMBOL pmos4 848 -1168 R0
SYMATTR InstName Ma9
SYMATTR Value2 l=50n w=500n
SYMBOL pmos4 1120 -1168 R0
SYMATTR InstName Ma10
SYMATTR Value2 l=50n w=500n
SYMBOL nmos4 624 -768 M0
SYMATTR InstName Ma11
SYMATTR Value2 l=250n w=45n
SYMBOL nmos4 1856 -720 M0
SYMATTR InstName Ma12
SYMATTR Value2 l=50n w=500n
SYMBOL nmos4 2064 -720 R0
SYMATTR InstName Ma13
SYMATTR Value2 l=50n w=500n
SYMBOL voltage -608 -1792 R0
SYMATTR InstName Vdd2
SYMATTR Value 5
SYMBOL pmos4 1856 -928 M0
SYMATTR InstName Ma14
SYMATTR Value2 l=50n w=500n
SYMBOL pmos4 1328 -256 M0
SYMATTR InstName Mf1
SYMATTR Value2 l=50n w=500n
SYMBOL pmos4 1728 32 R0
SYMATTR InstName Mf2
SYMATTR Value2 l=50u w=500u
SYMBOL pmos4 2080 32 M0
SYMATTR InstName Mf3
SYMATTR Value2 l=50u w=500u
SYMBOL pmos4 1872 -256 R0
SYMATTR InstName Mf4
SYMATTR Value2 l=50u w=475u
SYMBOL nmos4 1584 192 M0
WINDOW 0 56 32 Left 1
SYMATTR InstName Mf5
SYMATTR Value2 l=50n w=250n
SYMBOL nmos4 1680 192 R0
WINDOW 0 56 32 Left 1
WINDOW 3 56 72 Left 1
SYMATTR InstName Mf6
SYMATTR Value2 l=50n w=250n
SYMBOL nmos4 1936 192 M0
WINDOW 0 56 32 Left 1
WINDOW 3 56 72 Left 1
SYMATTR InstName Mf7
SYMATTR Value2 l=50n w=250n
SYMBOL nmos4 2080 192 M0
WINDOW 0 56 32 Left 1
WINDOW 3 56 72 Left 1
SYMATTR InstName Mf8
SYMATTR Value2 l=50n w=250n
SYMBOL voltage 2384 -144 R0
SYMATTR InstName Vf1
SYMATTR Value 0.705
SYMBOL voltage 2560 -144 R0
SYMATTR InstName Vf2
SYMATTR Value 2.38
SYMBOL voltage -464 -1792 R0
SYMATTR InstName V1_a
SYMATTR Value 1
SYMBOL pmos4 1488 -256 R0
SYMATTR InstName Mf9
SYMATTR Value2 l=50n w=500n
SYMBOL res 1264 -112 R90
WINDOW 0 0 56 VBottom 2
WINDOW 3 32 56 VTop 2
SYMATTR InstName R6
SYMATTR Value 0.1k
SYMBOL voltage -1328 1776 R0
SYMATTR InstName N1_reset
SYMATTR Value 60m
SYMBOL voltage 3392 1728 R0
SYMATTR InstName N3_reset
SYMATTR Value 60m
SYMBOL pmos4 -768 2560 R270
SYMATTR InstName M21
SYMATTR Value2 l=50n w=1u
SYMBOL nmos4 -1008 2768 R0
SYMATTR InstName M22
SYMATTR Value2 l=50n w=500n
SYMBOL nmos4 -1008 2896 R0
SYMATTR InstName M23
SYMATTR Value2 l=50n w=500n
SYMBOL pmos4 -1008 2576 M180
SYMATTR InstName M24
SYMATTR Value2 l=50n w=1u
SYMBOL pmos4 -1008 2704 M180
SYMATTR InstName M25
SYMATTR Value2 l=50n w=1u
SYMBOL nmos4 -672 2832 R90
SYMATTR InstName M26
SYMATTR Value2 l=50n w=1.125u
SYMBOL cap -1520 2720 R0
SYMATTR InstName C5
SYMATTR Value 0.2µ
SYMATTR SpiceLine Rser=333k Cpar=0.0000003
SYMBOL nmos4 -1648 2704 R0
SYMATTR InstName M27
SYMATTR Value2 l=5u w=500u
SYMBOL nmos4 -1392 2704 R0
SYMATTR InstName M28
SYMATTR Value2 l=5u w=500u
SYMBOL current -2112 2816 R180
WINDOW 0 24 80 Left 2
WINDOW 3 24 0 Left 2
SYMATTR InstName I2
SYMATTR Value PULSE(0 1m 3.2m 0 0 .5m 1m 12)
SYMBOL nmos4 32 2752 R0
SYMATTR InstName M29
SYMATTR Value2 l=50n w=250n
SYMBOL pmos4 32 2576 R0
SYMATTR InstName M30
SYMATTR Value2 l=50n w=1u
SYMBOL cap 32 3120 R270
WINDOW 0 32 32 VTop 2
WINDOW 3 0 32 VBottom 2
SYMATTR InstName C6
SYMATTR Value 0.1µ
SYMBOL res -128 2944 M0
SYMATTR InstName R10
SYMATTR Value 10k
SYMBOL Digital/or 336 3024 M0
SYMATTR InstName A7
SYMBOL Digital/or -464 3056 M0
SYMATTR InstName A8
SYMBOL Digital/and 432 2640 R0
SYMATTR InstName A9
SYMBOL res 736 2832 R0
SYMATTR InstName R11
SYMATTR Value 2k
SYMBOL voltage -1344 3184 R0
SYMATTR InstName V4
SYMATTR Value N2_reset
SYMBOL res 1520 320 R0
SYMATTR InstName R8
SYMATTR Value 1
SYMBOL Digital/or -880 -208 R270
SYMATTR InstName A10
SYMBOL Digital/or -1200 -208 R270
SYMATTR InstName A11
SYMBOL Digital/or -656 -736 R0
SYMATTR InstName A12
SYMBOL Digital/or 1920 1120 R0
SYMATTR InstName A13
SYMBOL res 2384 1152 R90
WINDOW 0 0 56 VBottom 2
WINDOW 3 32 56 VTop 2
SYMATTR InstName R7
SYMATTR Value 0.001k
SYMBOL Digital/or 1728 592 R90
SYMATTR InstName A14
SYMBOL Digital/or 1920 1328 R0
SYMATTR InstName A15
SYMBOL pmos4 -784 3952 R270
SYMATTR InstName M31
SYMATTR Value2 l=50n w=1u
SYMBOL nmos4 -1024 4160 R0
SYMATTR InstName M32
SYMATTR Value2 l=50n w=500n
SYMBOL nmos4 -1024 4288 R0
SYMATTR InstName M33
SYMATTR Value2 l=50n w=500n
SYMBOL pmos4 -1024 3968 M180
SYMATTR InstName M34
SYMATTR Value2 l=50n w=1u
SYMBOL pmos4 -1024 4096 M180
SYMATTR InstName M35
SYMATTR Value2 l=50n w=1u
SYMBOL nmos4 -688 4224 R90
SYMATTR InstName M36
SYMATTR Value2 l=50n w=1.125u
SYMBOL cap -1536 4112 R0
SYMATTR InstName C7
SYMATTR Value 0.2µ
SYMATTR SpiceLine Rser=333k Cpar=0.0000003
SYMBOL nmos4 -1664 4096 R0
SYMATTR InstName M37
SYMATTR Value2 l=5u w=500u
SYMBOL nmos4 -1408 4096 R0
SYMATTR InstName M38
SYMATTR Value2 l=5u w=500u
SYMBOL current -2128 4208 R180
WINDOW 0 24 80 Left 2
WINDOW 3 24 0 Left 2
SYMATTR InstName I3
SYMATTR Value PULSE(0 1m 3.2m 0 0 .5m 1m 12)
SYMBOL nmos4 16 4144 R0
SYMATTR InstName M39
SYMATTR Value2 l=50n w=250n
SYMBOL pmos4 16 3968 R0
SYMATTR InstName M40
SYMATTR Value2 l=50n w=1u
SYMBOL cap 16 4512 R270
WINDOW 0 32 32 VTop 2
WINDOW 3 0 32 VBottom 2
SYMATTR InstName C8
SYMATTR Value 0.1µ
SYMBOL res -144 4336 M0
SYMATTR InstName R9
SYMATTR Value 10k
SYMBOL Digital/or 320 4416 M0
SYMATTR InstName A16
SYMBOL Digital/or -480 4448 M0
SYMATTR InstName A17
SYMBOL Digital/and 416 4032 R0
SYMATTR InstName A18
SYMBOL res 720 4224 R0
SYMATTR InstName R12
SYMATTR Value 2k
SYMBOL voltage -1360 4576 R0
SYMATTR InstName V1
SYMATTR Value N2_reset
SYMBOL Digital/or 1920 1584 R0
SYMATTR InstName A19
SYMBOL Digital/or -656 -208 R270
SYMATTR InstName A20
TEXT -2256 800 Left 2 !.tran 0 30m 0 30m
RECTANGLE Normal -1112 1040 -436 1604 2
RECTANGLE Normal 3608 992 4284 1556 2
RECTANGLE Normal -1128 2448 -452 3012 2
RECTANGLE Normal -1144 3840 -468 4404 2

The netlist it stands for:
* 2N-A.asc
M1 N024 Vo 0 Vdd PMOS l=50n w=1u
M2 Vo Vm N032 0 NMOS l=50n w=500n
M3 N032 Vm 0 0 NMOS l=50n w=500n
M4 N024 Vm Vdd Vdd PMOS l=50n w=1u
M5 Vo Vm N024 Vdd PMOS l=50n w=1u
M6 Vdd Vo N032 0 NMOS l=50n w=1.125u
C1 Vm N039 0.2µ Rser=333k Cpar=0.0000003
M7 Vm V_lk N039 0 NMOS l=5u w=500u
M8 Vm Vsw N039 0 NMOS l=5u w=500u
Vdd1 Vdd 0 0.9 Rser=1M
V_lk1 V_lk 0 0.8
I1 0 Vm PULSE(0 1m 3m 0 0 .5m 1m 12)
Vcc1 Vcc 0 1
M9 Vout Vo GND N030 NMOS l=50n w=250n
M10 Vdd Vo Vout N027 PMOS l=50n w=1u
C2 N036 N037 0.25µ
R1 Vcc N036 10k
A1 0 N016 0 Vsw 0 N037 0 0 OR
A2 0 N036 0 N036 0 Vsw 0 0 OR
A3 0 Vdd 0 Vout 0 0 N025 0 AND
M11 N023 Vo3 0 Vdd PMOS l=50n w=1u
M12 Vo3 Vm3 N031 0 NMOS l=50n w=500n
M13 N031 Vm3 0 0 NMOS l=50n w=500n
M14 N023 Vm3 Vdd Vdd PMOS l=50n w=1u
M15 Vo3 Vm3 N023 Vdd PMOS l=50n w=1u
M16 Vdd Vo3 N031 0 NMOS l=50n w=1.125u
C3 Vm3 N038 0.2µ Rser=333k Cpar=0.0000003
M17 Vm3 V_lk N038 0 NMOS l=5u w=500u
M18 Vm3 Vsw3 N038 0 NMOS l=5u w=500u
M19 Vout3 Vo3 GND N029 NMOS l=50n w=250n
M20 Vdd Vo3 Vout3 N026 PMOS l=50n w=1u
C4 N034 N035 0.25µ
R2 Vcc N034 10k
A4 0 N3_V 0 Vsw3 0 N035 0 0 OR
A5 0 N034 0 N034 0 Vsw3 0 0 OR
A6 0 Vdd 0 Vout3 0 0 N3_V 0 AND
R3 0 N3_V 1k
R4 N025 N016 2k
Ma1 N001 V2_a N011 0 NMOS l=250n w=45n
Ma2 Vq N005 0 0 NMOS l=250n w=50n
Cq1 Vq 0 1pF
R5 N005 N012 6k
Va1 N012 0 1.5
Ma3 N006 N006 0 0 NMOS l=50n w=500n
Ma4 Vdd_a N001 N001 Vdd_a PMOS l=50n w=500n
Ma5 N003 Vq N006 Vdd_a PMOS l=50n w=500n
Ma6 Vdd_a N004 N004 Vdd_a PMOS l=50n w=460n
Ma7 Vdd_a N004 Vp Vdd_a PMOS l=50n w=460n
Cp1 Vp 0 1pF
Ra1 Vp 0 115K
Ia1 N011 0 20µ
Ia2 Vdd_a N003 20µ
Ia3 Vp 0 9.8µ
Ma8 Vdd_a N002 N002 Vdd_a PMOS l=50n w=500n
Ma9 Vdd_a N002 N005 Vdd_a PMOS l=50n w=500n
Ma10 Vdd_a N002 Vq Vdd_a PMOS l=50n w=500n
Ma11 N002 V1_a N011 0 NMOS l=250n w=45n
Ma12 N007 N007 0 0 NMOS l=50n w=500n
Ma13 N004 N007 0 0 NMOS l=50n w=500n
Vdd2 Vdd_a 0 5
Ma14 N003 0 N007 Vdd_a PMOS l=50n w=500n
Mf1 Vdd N013 N013 Vdd_a PMOS l=50n w=500n
Mf2 N015 0 N017 Vdd_a PMOS l=50u w=500u
Mf3 N015 Vp N018 Vdd_a PMOS l=50u w=500u
Mf4 Vdd Vf1 N015 Vdd_a PMOS l=50u w=475u
Mf5 N014 N017 N020 0 NMOS l=50n w=250n
Mf6 N017 N017 0 0 NMOS l=50n w=250n
Mf7 N017 Vf2 0 0 NMOS l=50n w=250n
Mf8 N018 N018 0 0 NMOS l=50n w=250n
Vf1 Vf2 0 0.705
Vf2 Vf1 0 2.38
V1_a V1_a 0 1
Mf9 Vdd N013 N014 Vdd_a PMOS l=50n w=500n
R6 N013 0 0.1k
V§N1_reset N039 0 60m
V§N3_reset N038 0 60m
M21 N040 Vo2 0 Vdd PMOS l=50n w=1u
M22 Vo2 Vm2 N043 0 NMOS l=50n w=500n
M23 N043 Vm2 0 0 NMOS l=50n w=500n
M24 N040 Vm2 Vdd Vdd PMOS l=50n w=1u
M25 Vo2 Vm2 N040 Vdd PMOS l=50n w=1u
M26 Vdd Vo2 N043 0 NMOS l=50n w=1.125u
C5 Vm2 N046 0.2µ Rser=333k Cpar=0.0000003
M27 Vm2 V_lk N046 0 NMOS l=5u w=500u
M28 Vm2 Vsw2 N046 0 NMOS l=5u w=500u
I2 0 Vm2 PULSE(0 1m 3.2m 0 0 .5m 1m 12)
M29 Vout2 Vo2 GND N042 NMOS l=50n w=250n
M30 Vdd Vo2 Vout2 N041 PMOS l=50n w=1u
C6 N044 N045 0.1µ
R10 Vcc N044 10k
A7 0 N019 0 Vsw2 0 N045 0 0 OR
A8 0 N044 0 N044 0 Vsw2 0 0 OR
A9 0 Vdd 0 Vout2 0 0 N028 0 AND
R11 N028 N019 2k
V4 N046 0 N2_reset
R8 N020 0 1
A10 0 N016 0 0 0 0 N010 0 OR
A11 0 N019 0 0 0 0 N008 0 OR
A12 0 N008 N009 N010 0 0 V2_a 0 OR
A13 0 N025 0 0 0 0 N022 0 OR
R7 Vm3 N022 0.001k
A14 0 0 0 N017 0 0 N022 0 OR
A15 0 N028 0 0 0 0 N022 0 OR
M31 N047 Vo4 0 Vdd PMOS l=50n w=1u
M32 Vo4 Vm4 N050 0 NMOS l=50n w=500n
M33 N050 Vm4 0 0 NMOS l=50n w=500n
M34 N047 Vm4 Vdd Vdd PMOS l=50n w=1u
M35 Vo4 Vm4 N047 Vdd PMOS l=50n w=1u
M36 Vdd Vo4 N050 0 NMOS l=50n w=1.125u
C7 Vm4 N053 0.2µ Rser=333k Cpar=0.0000003
M37 Vm4 V_lk N053 0 NMOS l=5u w=500u
M38 Vm4 Vsw4 N053 0 NMOS l=5u w=500u
I3 0 Vm4 PULSE(0 1m 3.2m 0 0 .5m 1m 12)
M39 Vout4 Vo4 GND N049 NMOS l=50n w=250n
M40 Vdd Vo4 Vout4 N048 PMOS l=50n w=1u
C8 N051 N052 0.1µ
R9 Vcc N051 10k
A16 0 N021 0 Vsw4 0 N052 0 0 OR
A17 0 N051 0 N051 0 Vsw4 0 0 OR
A18 0 Vdd 0 Vout4 0 0 N033 0 AND
R12 N033 N021 2k
V1 N053 0 N2_reset
A19 0 N033 0 0 0 0 N022 0 OR
A20 0 N021 0 0 0 0 N009 0 OR
.model NMOS NMOS
.model PMOS PMOS
.lib standard.mos
.tran 0 30m 0 30m
.backanno
.end